# EAGLE design RevA (EAGLE 6.2)
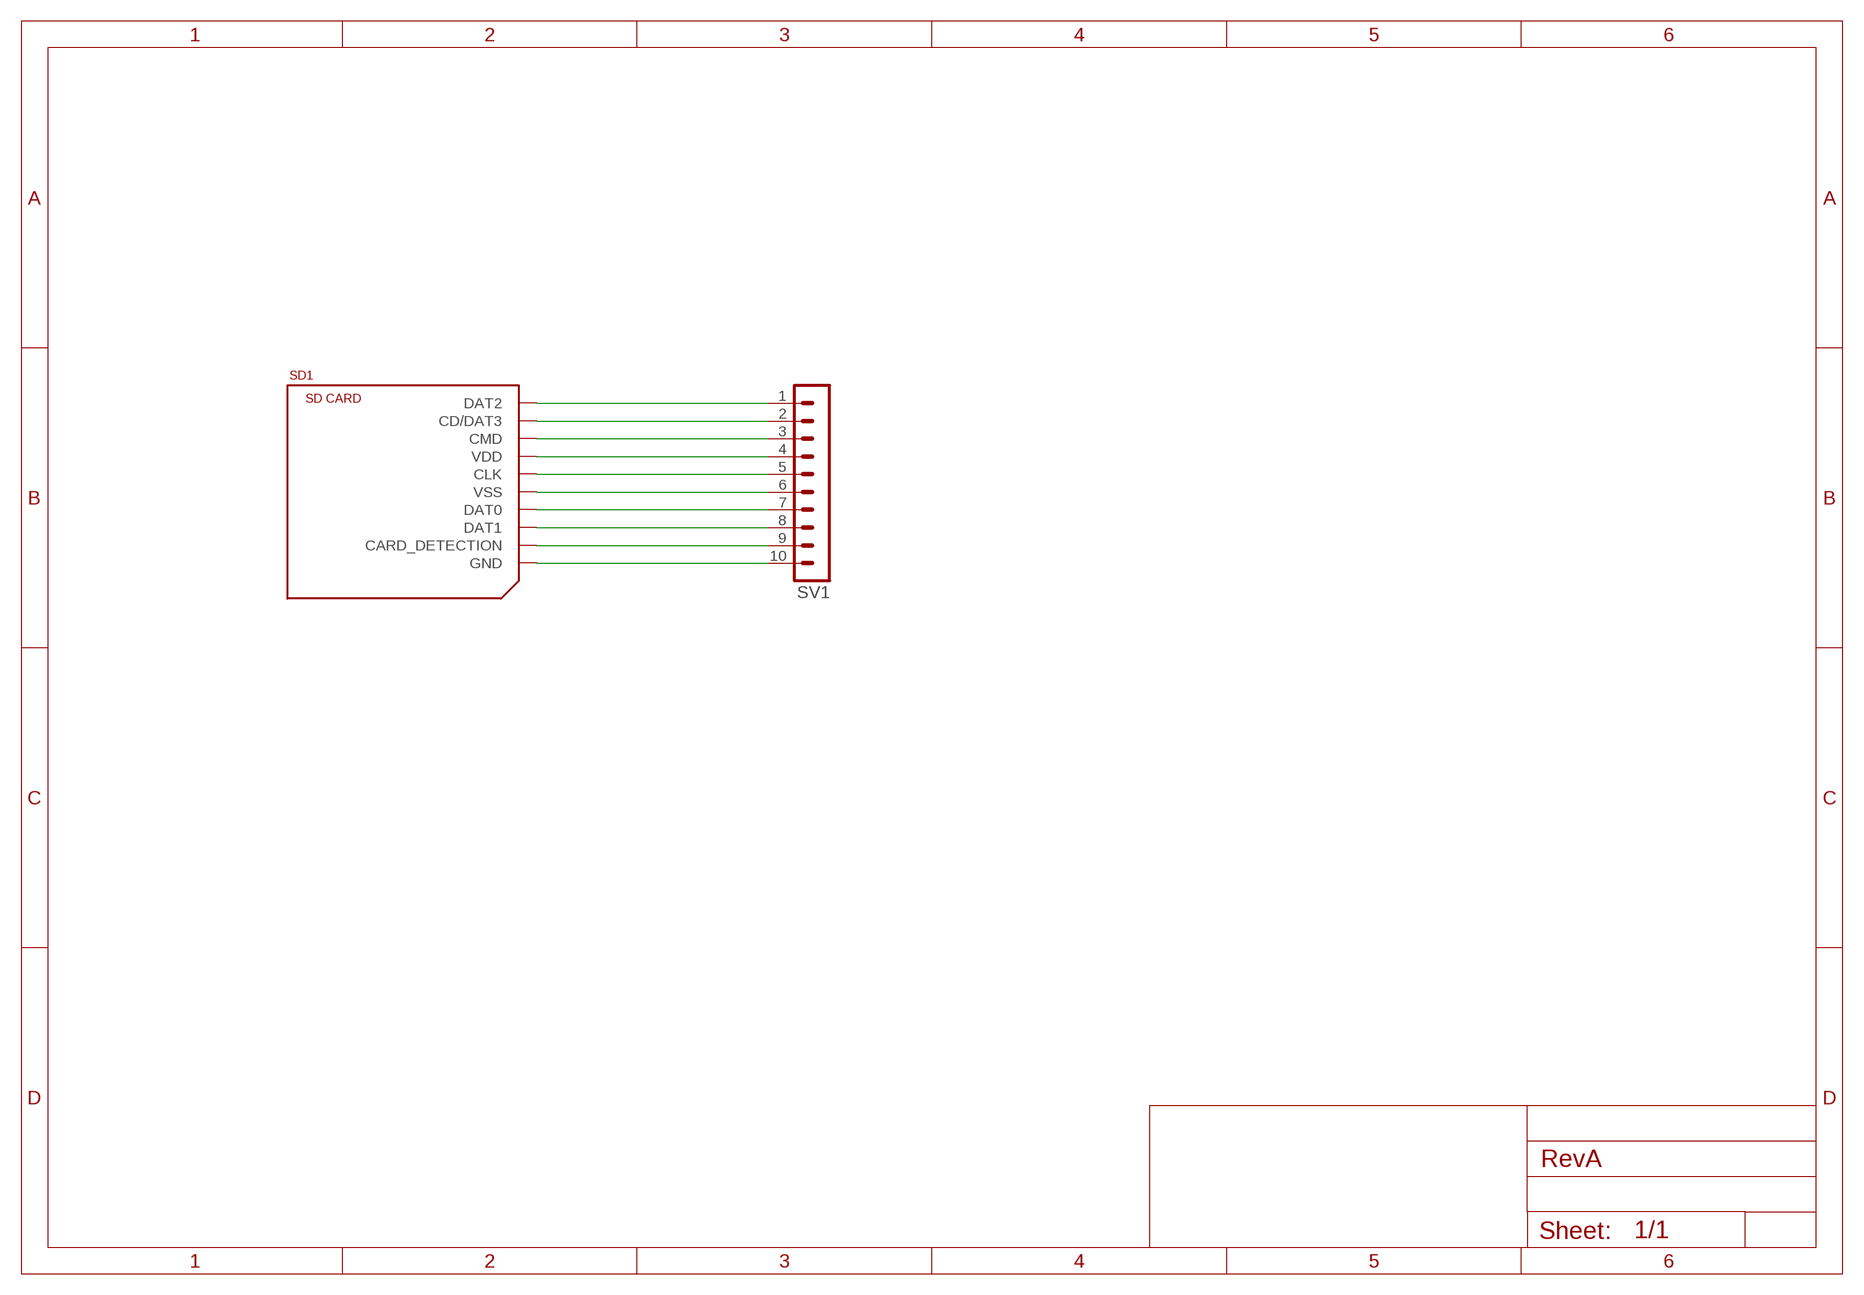
[diagram p0: schematic, sheet 1]

## Parts
SD1  SDCARD  [SD]
SV1  MA10-1  [MA10-1]

## Nets
GND: SD1.P$6(VSS) SD1.P$10(GND) SV1.6 SV1.10
N$1: SD1.P$1(DAT2) SV1.1
N$2: SD1.P$2(CD/DAT3) SV1.2
N$3: SD1.P$3(CMD) SV1.3
N$4: SD1.P$4(VDD) SV1.4
N$5: SD1.P$5(CLK) SV1.5
N$7: SD1.P$7(DAT0) SV1.7
N$8: SD1.P$8(DAT1) SV1.8
N$9: SD1.P$9(CARD_DETECTION) SV1.9

## Library data of the parts
SD1 = SDCARD:SDCARD: SD CARD CONNECTOR
SV1 = con-lstb:MA10-1: PIN HEADER; OC_FARNELL: unknown; OC_NEWARK: unknown

## Board
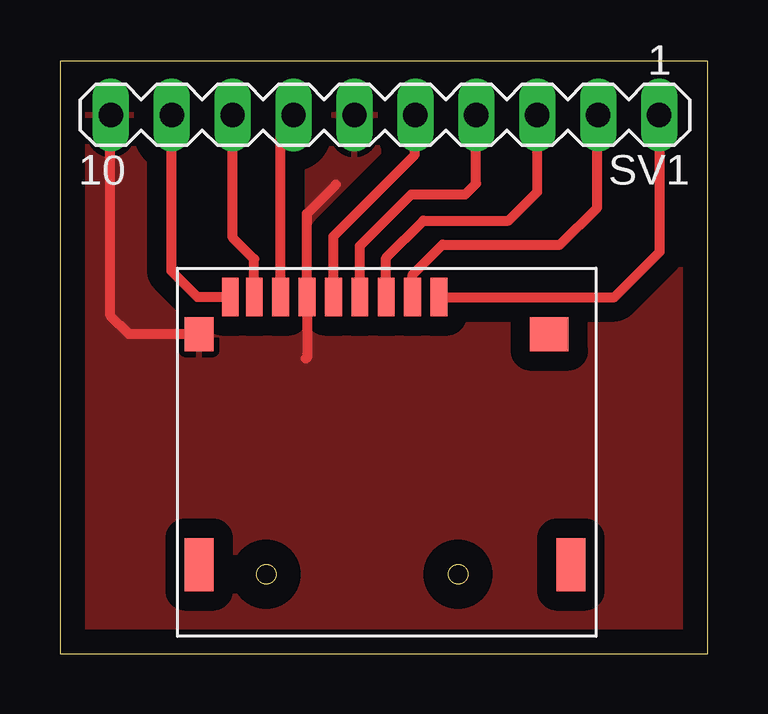
[diagram p1: board, top side]

Size 27 x 24.7 mm. Coordinates in mm from the lower left corner, seen from the top.
Outline: 0,0 27,0 27,24.7 0,24.7 0,0
Copper layers (1*16): Top 0.035mm / dielectric 1.5mm / Bottom 0.035mm
Design rules: minimum track width 10mil, minimum drill 24mil, track to track 8mil, track to pad 8mil, pad to pad 8mil, via to via 8mil, smd to smd 8mil, copper to edge 40mil, drill to drill 8mil, minimum pad ring 10mil, minimum via ring 8mil, stop-mask expansion 4mil, vias tented up to drill 0mil, thermal gap 10mil

### Footprints (pad centres in the part's own frame; a part is rotated, then mirrored left to right if it is on the bottom)
SD = smd 0.7 x 1.6: P$1 2.25,6.47; P$2 1.15,6.47; P$3 0.05,6.47; P$4 -1.05,6.47; P$5 -2.15,6.47; P$6 -3.25,6.47; P$7 -4.35,6.47; P$8 -5.45,6.47; P$9 -6.45,6.47 | smd 1.2 x 1.4: P$10 -7.75,4.92 | smd 1.6 x 1.4: P$11 6.85,4.92 | smd 1.2 x 2.2: P$12 -7.75,-4.68; P$13 7.75,-4.68
MA10-1 = drill 1.016 long: 1 -11.43,0; 2 -8.89,0; 3 -6.35,0; 4 -3.81,0; 5 -1.27,0; 6 1.27,0; 7 3.81,0; 8 6.35,0; 9 8.89,0; 10 11.43,0

### Placement (x,y rotation side)
SD1  13.55,8.4 0 top
SV1  13.55,22.46 180 top

### Tracks (layer width: path | path; a pad name or v marks a point on that pad's centre or on a via)
GND
  Top 0.406: SD1.P$10 2.88,13.32 2.1,14.1 2.1,22.44 SV1.10 | 10.25,12.3 10.3,12.35 SD1.P$6 10.3,18.35 11.5,19.55
  pour Top (isolate 0.813): 0,24.75 27,24.75 27,0 0,0
N$1
  Top 0.406: SD1.P$1 23.12,14.87 25,16.75 25,22.44 SV1.1
N$2
  Top 0.406: SD1.P$2 14.7,15.8 15.95,17.05 20.85,17.05 22.4,18.6 22.4,22.42 SV1.2
N$3
  Top 0.406: SD1.P$3 13.6,16.5 15.15,18.05 18.7,18.05 19.9,19.25 SV1.3
N$4
  Top 0.406: SD1.P$4 12.5,17 14.65,19.15 16.9,19.15 17.35,19.6 SV1.4
N$5
  Top 0.406: SD1.P$5 11.4,17.4 14.8,20.8 14.8,22.44 SV1.5
N$7
  Top 0.406: SD1.P$7 9.2,21.92 SV1.7
N$8
  Top 0.406: SD1.P$8 8.1,16.45 7.2,17.35 SV1.8
N$9
  Top 0.406: SD1.P$9 5.73,14.87 4.65,15.95 SV1.9